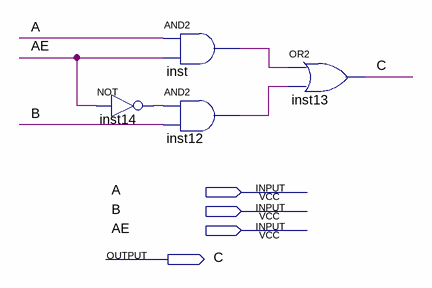
[diagram p0: schematic sheet]
// Quartus schematic mux_1_bit.bdf as structural Verilog: 4 symbols, 4 pins
module mux_1_bit (
  input  A,
  input  B,
  input  AE,
  output C
);

  wire inst12_out, inst14_out, inst_out;

  and inst (inst_out, A, AE);
  and inst12 (inst12_out, inst14_out, B);
  not inst14 (inst14_out, AE);
  or inst13 (C, inst_out, inst12_out);
endmodule
